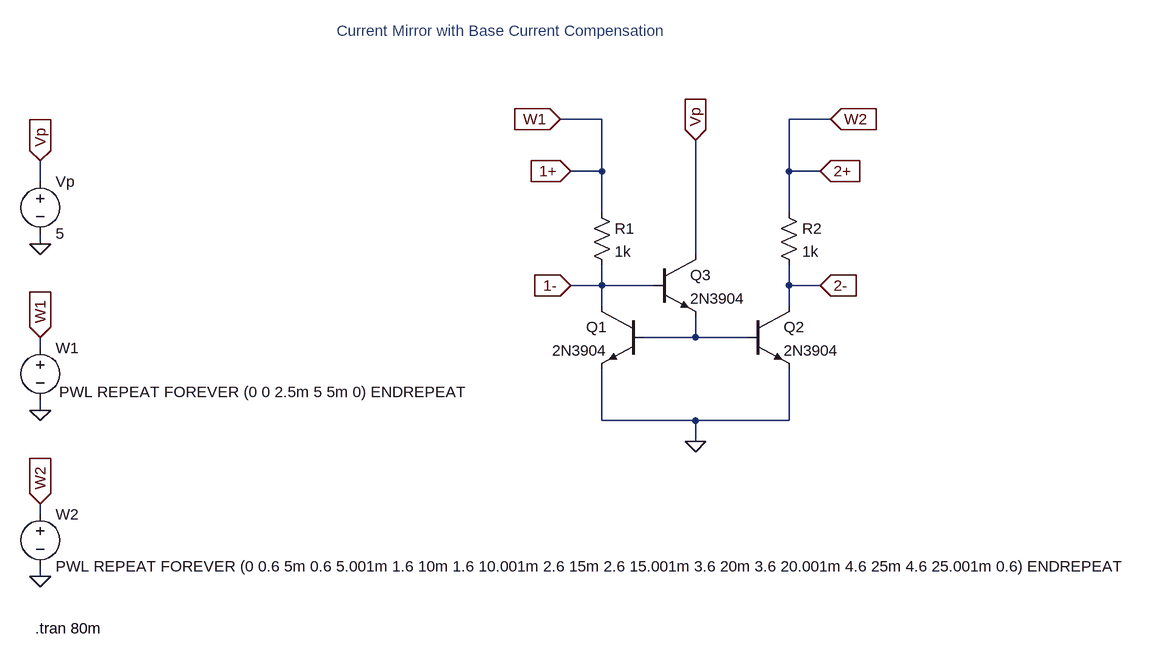
[diagram p0: schematic current_mirror_base_current_comp.asc]
current_mirror_base_current_comp.asc, the LTspice schematic file:
Version 4
SHEET 1 2016 1044
WIRE -208 -64 -272 -64
WIRE 144 -64 80 -64
WIRE -208 16 -208 -64
WIRE -208 16 -256 16
WIRE 80 16 80 -64
WIRE 128 16 80 16
WIRE -1072 32 -1072 0
WIRE -208 80 -208 16
WIRE 80 80 80 16
WIRE -1072 128 -1072 112
WIRE -64 144 -64 -32
WIRE -208 192 -208 160
WIRE -208 192 -256 192
WIRE -128 192 -208 192
WIRE 80 192 80 160
WIRE 128 192 80 192
WIRE -208 224 -208 192
WIRE 80 224 80 192
WIRE -64 272 -64 240
WIRE -64 272 -144 272
WIRE 16 272 -64 272
WIRE -1072 288 -1072 272
WIRE -1072 384 -1072 368
WIRE -208 400 -208 320
WIRE -64 400 -208 400
WIRE 80 400 80 320
WIRE 80 400 -64 400
WIRE -64 432 -64 400
WIRE -1072 544 -1072 528
WIRE -1072 640 -1072 624
FLAG -1072 384 0
FLAG -1072 640 0
FLAG -1072 272 W1
IOPIN -1072 272 In
FLAG -1072 528 W2
IOPIN -1072 528 In
FLAG -64 432 0
FLAG -272 -64 W1
IOPIN -272 -64 In
FLAG 144 -64 W2
IOPIN 144 -64 In
FLAG -256 16 1+
IOPIN -256 16 In
FLAG -256 192 1-
IOPIN -256 192 In
FLAG 128 16 2+
IOPIN 128 16 In
FLAG 128 192 2-
IOPIN 128 192 In
FLAG -64 -32 Vp
IOPIN -64 -32 In
FLAG -1072 128 0
FLAG -1072 0 Vp
IOPIN -1072 0 In
SYMBOL voltage -1072 272 R0
WINDOW 3 29 84 Left 2
WINDOW 123 0 0 Left 0
WINDOW 39 0 0 Left 0
SYMATTR Value PWL REPEAT FOREVER (0 0 2.5m 5 5m 0) ENDREPEAT
SYMATTR InstName W1
SYMBOL voltage -1072 528 R0
WINDOW 123 0 0 Left 0
WINDOW 39 0 0 Left 0
SYMATTR InstName W2
SYMATTR Value PWL REPEAT FOREVER (0 0.6 5m 0.6 5.001m 1.6 10m 1.6 10.001m 2.6 15m 2.6 15.001m 3.6 20m 3.6 20.001m 4.6 25m 4.6 25.001m 0.6) ENDREPEAT
SYMBOL res -224 64 R0
SYMATTR InstName R1
SYMATTR Value 1k
SYMBOL res 64 64 R0
SYMATTR InstName R2
SYMATTR Value 1k
SYMBOL npn -144 224 M0
SYMATTR InstName Q1
SYMATTR Value 2N3904
SYMBOL npn 16 224 R0
SYMATTR InstName Q2
SYMATTR Value 2N3904
SYMBOL npn -128 144 R0
SYMATTR InstName Q3
SYMATTR Value 2N3904
SYMBOL voltage -1072 16 R0
SYMATTR InstName Vp
SYMATTR Value 5
TEXT -616 -200 Left 2 ;Current Mirror with Base Current Compensation
TEXT -1080 720 Left 2 !.tran 80m

The netlist it stands for:
* current_mirror_base_current_comp.asc
V§W1 1+ 0 PWL REPEAT FOREVER (0 0 2.5m 5 5m 0) ENDREPEAT
V§W2 2+ 0 PWL REPEAT FOREVER (0 0.6 5m 0.6 5.001m 1.6 10m 1.6 10.001m 2.6 15m 2.6 15.001m 3.6 20m 3.6 20.001m 4.6 25m 4.6 25.001m 0.6) ENDREPEAT
R1 1+ 1- 1k
R2 2+ 2- 1k
Q1 1- N001 0 0 2N3904
Q2 2- N001 0 0 2N3904
Q3 Vp 1- N001 0 2N3904
Vp Vp 0 5
.model NPN NPN
.model PNP PNP
.lib standard.bjt
* Current Mirror with Base Current Compensation
.tran 80m
.backanno
.end